# Altium schematic sheet Input Power.SchDoc
size A; SheetNumber: 1; SheetTotal: 5
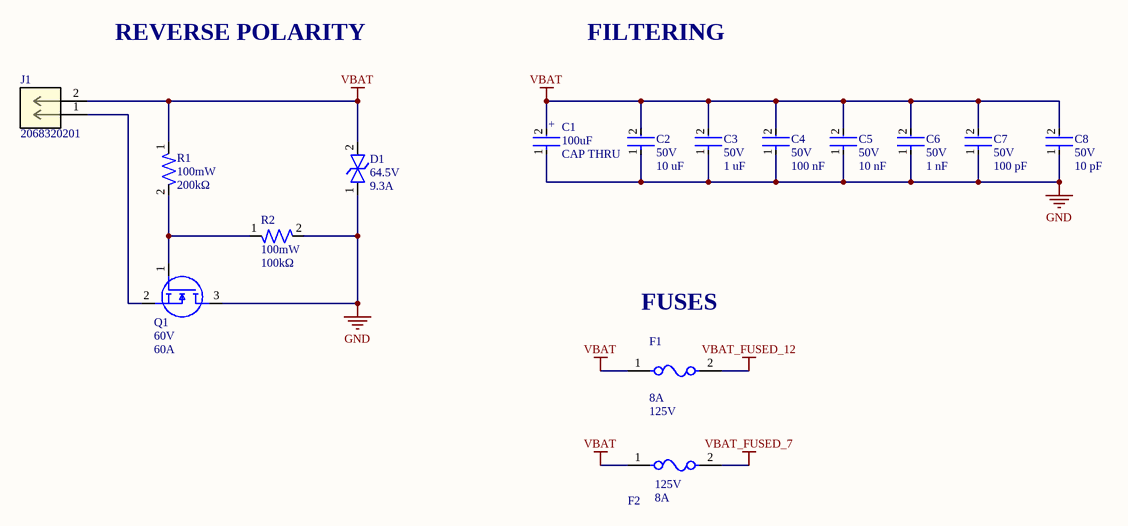
[diagram p0: Input Power.SchDoc]

## Parts
C1  CAP THRU  value 100uF  [WCAP-ATUL_8X11.5(DXL)]
C2  Voltage Rating: 50V  Capacitance: 10 uF  [CAP-1210]  (hidden comment: CAP 1210)
C3  Voltage Rating: 50V  Capacitance: 1 uF  [CAP-1210]  (hidden comment: CAP 1210)
C4  Voltage Rating: 50V  Capacitance: 100 nF  [CAP-1210]  (hidden comment: CAP 1210)
C5  Voltage Rating: 50V  Capacitance: 10 nF  [CAP-1210]  (hidden comment: CAP 1210)
C6  Voltage Rating: 50V  Capacitance: 1 nF  [CAP-1210]  (hidden comment: CAP 1210)
C7  Voltage Rating: 50V  Capacitance: 100 pF  [CAP-1210]  (hidden comment: CAP 1210)
C8  Voltage Rating: 50V  Capacitance: 10 pF  [CAP-1210]  (hidden comment: CAP 1210)
D1  Voltage Rating: 64.5V  Current Rating: 9.3A  [DO-214AA (SMBJ)]  (hidden comment: SMBJ40CA)
F1  Fuse Current: 8A  Voltage Rating: 125V  [FUSE-0001]  (hidden comment: 01550900M)
F2  Fuse Current: 8A  Voltage Rating: 125V  [FUSE-0001]  (hidden comment: 01550900M)
J1  2068320201  [CONN_2068320000-SD_02_MOL]
Q1  Voltage: 60V  Continuous Current: 60A  [IC-8VSONCLIP]  (hidden comment: CSD18543Q3AT)
R1  Wattage: 100mW  Resistance: 200kΩ  [RES-0805]  (hidden comment: RES 0805)
R2  Wattage: 100mW  Resistance: 100kΩ  [RES-0805]  (hidden comment: RES 0805)

## Nets
GND: C1.1 C2.1 C3.1 C4.1 C5.1 C6.1 C7.1 C8.1 D1.1 Q1.3(D) R2.2
VBAT: C1.2 C2.2 C3.2 C4.2 C5.2 C6.2 C7.2 C8.2 D1.2 F1.1 F2.1 J1.2 R1.1
VBAT_FUSED_7: F2.2
VBAT_FUSED_12: F1.2
NetJ1_1: J1.1 Q1.2(S)
NetQ1_1: Q1.1(G) R1.2 R2.1

## Notes on the sheet
- REVERSE POLARITY
- FILTERING
- FUSES
- (in symbol CAP THRU) +

## Library data of the parts
C1 = CAP THRU: MF: {'manufacturer': u'W\xfcrth Elektronik'}; MP: 860040674004; Package: None; Price: None; Availability: Unavailable
D1 = DIO-TVS-0001: TVS DIODE 40VWM 64.5VC DO214AA; ComponentLink1Description: Datasheet; ComponentLink1URL: https://www.littelfuse.com/media?resourcetype=datasheets&itemid=09a6ae9a-73cb-4ac4-acac-e6dab92ab953&filename=littelfuse_tvs_diode_smbj_datasheet.pdf
F1 = FUSE-0001: FUSE BLOK CARTRIDGE 125V 10A SMD; ComponentLink2Description: Datasheet; ComponentLink2URL: https://www.littelfuse.com/~/media/electronics/datasheets/fuses/littelfuse_fuse_154_154t_154l_154tl_datasheet.pdf.pdf
F2 = CMP-08604-000021-1: FUSE BLOK CARTRIDGE 125V 10A SMD; ComponentLink2Description: Datasheet; ComponentLink2URL: https://www.littelfuse.com/~/media/electronics/datasheets/fuses/littelfuse_fuse_154_154t_154l_154tl_datasheet.pdf.pdf
J1 = CONN MF+ 2 PIN VERT: Micro-Fit+ Vertical Header, Through Hole, 3.00mm Pitch, Dual Row, 2 Circuits, Tin (Sn) Plating, Glow-Wire Capable, Black, Tray; Manufacturer_Name: Molex Connector Corporation; Copyright: Copyright (C) 2025 Ultra Librarian. All rights reserved.; Manufacturer_Part_Number: 2068320201; RefDes: RefDes; Type: Type
Q1 = NMOS-60A-0001: MOSFET N-CH 60V 12A/60A 8VSON; ComponentLink2Description: Datasheet; ComponentLink2URL: http://www.ti.com/lit/ds/symlink/csd18543q3a.pdf